# Altium project MCC17.PrjPCB
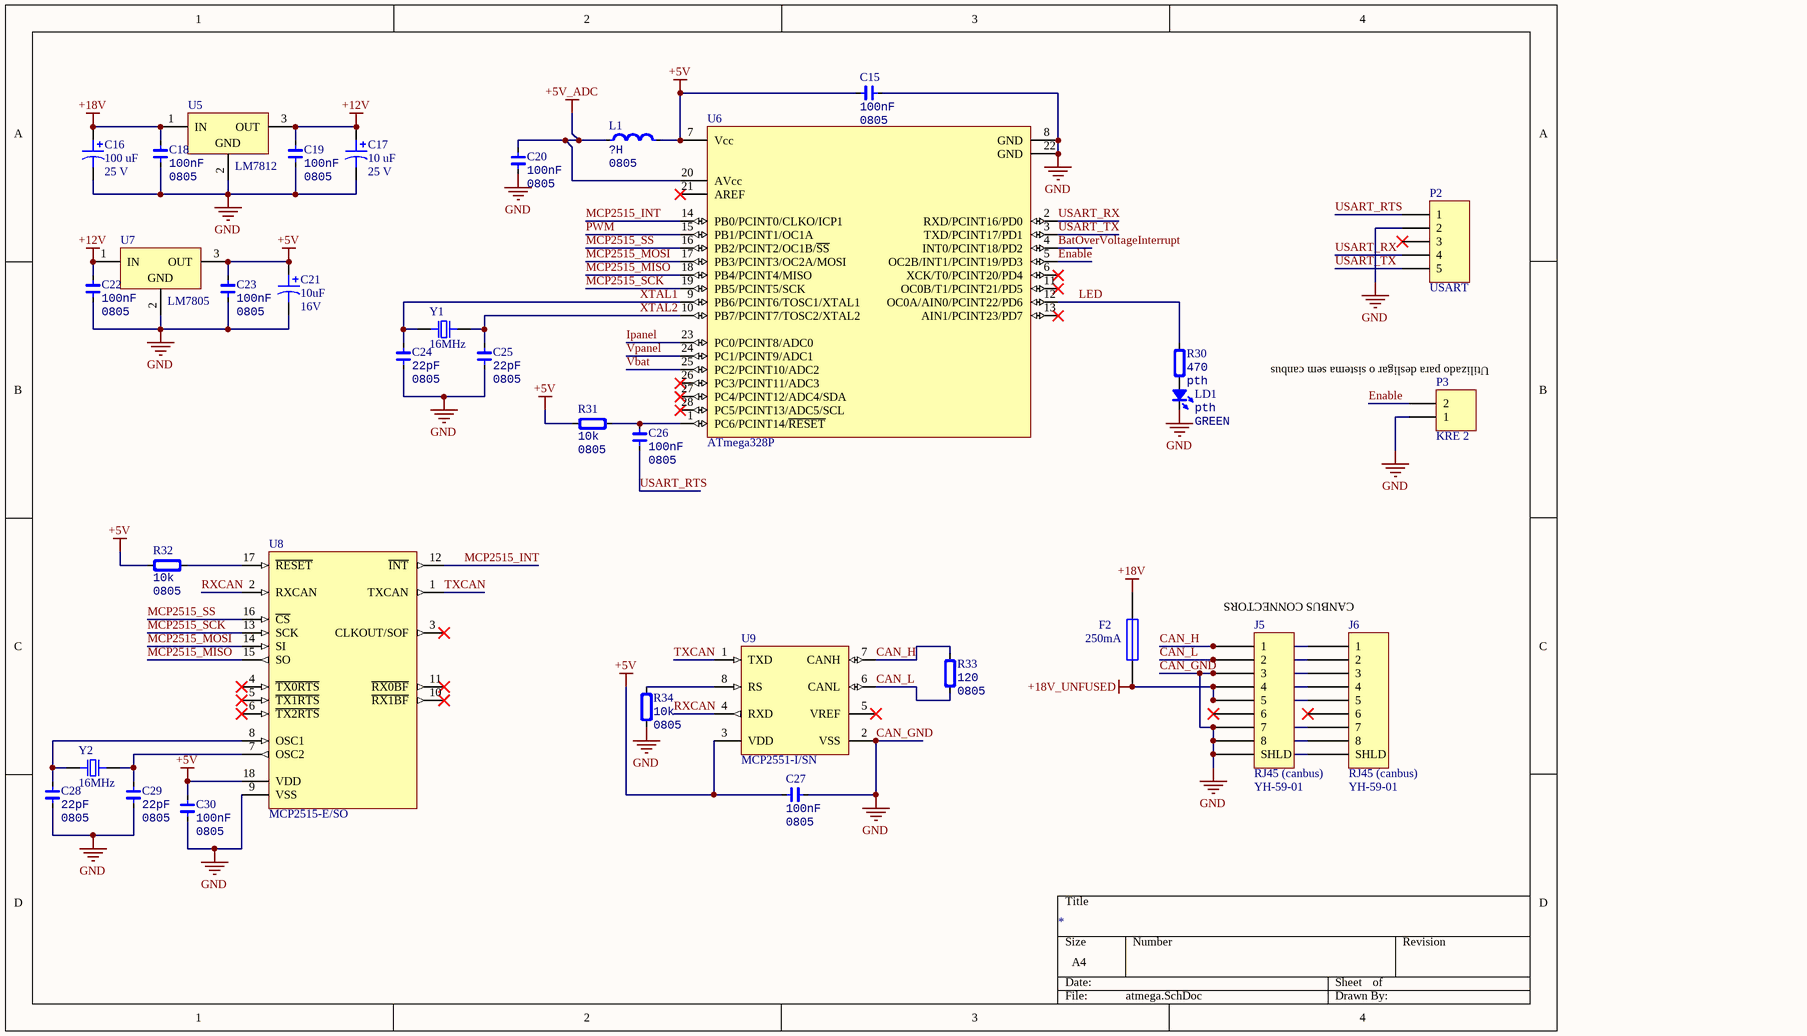
[diagram p0: atmega.SchDoc]
3 sheets, 114 parts. Net scope: global (net labels, ports and power ports of the same name join across sheets).
Board files: malllha.PcbDoc, MCC17.PcbDoc
Sheets:
  atmega.SchDoc
  signals.SchDoc
  cuk.SchDoc

## Sheet atmega.SchDoc
size A4

### Parts
C15  Type: 0805  [0805C]  (hidden comment: 100nF)
C16  value 100 uF  Voltage: 25 V  [cap10uF16V]  (hidden comment: CapacitorPol)
C17  value 10 uF  Voltage: 25 V  [cap10uF16V]  (hidden comment: CapacitorPol)
C18  Type: 0805  [0805C]  (hidden comment: 100nF)
C19  Type: 0805  [0805C]  (hidden comment: 100nF)
C20  Type: 0805  [0805C]  (hidden comment: 100nF)
C21  value 10uF  Voltage: 16V  [cap10uF16V]  (hidden comment: CapacitorPol)
C22  Type: 0805  [0805C]  (hidden comment: 100nF)
C23  Type: 0805  [0805C]  (hidden comment: 100nF)
C24  Type: 0805  [0805C]  (hidden comment: 22pF)
C25  Type: 0805  [0805C]  (hidden comment: 22pF)
C26  Type: 0805  [0805C]  (hidden comment: 100nF)
C27  Type: 0805  [0805C]  (hidden comment: 100nF)
C28  Type: 0805  [0805C]  (hidden comment: 22pF)
C29  Type: 0805  [0805C]  (hidden comment: 22pF)
C30  Type: 0805  [0805C]  (hidden comment: 100nF)
F2  250mA  [Porta Fusivel]
J5  RJ45 (canbus)  value YH-59-01  [ASSMANN A-2004-2-4-LP/FS]
J6  RJ45 (canbus)  value YH-59-01  [ASSMANN A-2004-2-4-LP/FS]
L1  Type: 0805  [0805L]  (hidden comment: ?H)
LD1  Type: pth  [LED3MM]  (hidden comment: GREEN)
P2  USART  [HDR1X5]
P3  KRE 2  [KRE_2]
R30  Type: pth  [AXIAL-0.3]  (hidden comment: 470)
R31  Type: 0805  [0805R]  (hidden comment: 10k)
R32  Type: 0805  [0805R]  (hidden comment: 10k)
R33  Type: 0805  [0805R]  (hidden comment: 120)
R34  Type: 0805  [0805R]  (hidden comment: 10k)
U5  LM7812  [TO220_deitado]
U6  ATmega328P  [DIP28-300(100)]
U7  LM7805  [TO220_deitado]
U8  MCP2515-E/SO  [WSO18_L]
U9  MCP2551-I/SN  [SOIC08-150(50)]
Y1  16MHz  [HC49-US-THT]
Y2  16MHz  [HC49-US-THT]

### Nets
+5V: C15.1 C21.1 C23.2 C27.1 C30.1 L1.2 R31.1 R32.1 U6.7(Vcc) U7.3(OUT) U8.18(VDD) U9.3(VDD)
+5V_ADC: C20.2 L1.1 U6.20(AVcc)
+12V: C17.1 C19.2 C22.2 U5.3(OUT) U7.1(IN)
+18V: C16.1 C18.2 F2.1 U5.1(IN)
+18V_UNFUSED: F2.2 J5.4 J5.5 J6.4 J6.5
CAN_GND: C15.2 C16.2 C17.2 C18.1 C19.1 C20.1 C21.2 C22.1 C23.1 C24.1 C25.1 C27.2 C28.1 C29.1 C30.2 J5.3 J5.7 J5.8 J5.S(SHLD) J6.3 J6.7 J6.8 J6.S(SHLD) LD1.2(K) P2.2 P3.1 R34.2 U5.2(GND) U6.8(GND) U6.22(GND) U7.2(GND) U8.9(VSS) U9.2(VSS)  [also labelled GND]
BatOverVoltageInterrupt: U6.4(INT0/PCINT18/PD2)
CAN_H: J5.1 J6.1 R33.2 U9.7(CANH)
CAN_L: J5.2 J6.2 R33.1 U9.6(CANL)
Enable: P3.2 U6.5(OC2B/INT1/PCINT19/PD3)
Ipanel: U6.23(PC0/PCINT8/ADC0)
LED: R30.2 U6.12(OC0A/AIN0/PCINT22/PD6)
MCP2515_INT: U6.14(PB0/PCINT0/CLKO/ICP1) U8.12(~{INT})
MCP2515_MISO: U6.18(PB4/PCINT4/MISO) U8.15(SO)
MCP2515_MOSI: U6.17(PB3/PCINT3/OC2A/MOSI) U8.14(SI)
MCP2515_SCK: U6.19(PB5/PCINT5/SCK) U8.13(SCK)
MCP2515_SS: U6.16(PB2/PCINT2/OC1B/~{SS}) U8.16(~{CS})
PWM: U6.15(PB1/PCINT1/OC1A)
RXCAN: U8.2(RXCAN) U9.4(RXD)
TXCAN: U8.1(TXCAN) U9.1(TXD)
USART_RTS: C26.2 P2.1
USART_RX: P2.4 U6.2(RXD/PCINT16/PD0)
USART_TX: P2.5 U6.3(TXD/PCINT17/PD1)
Vbat: U6.25(PC2/PCINT10/ADC2)
Vpanel: U6.24(PC1/PCINT9/ADC1)
XTAL1: C24.2 U6.9(PB6/PCINT6/TOSC1/XTAL1) Y1.1
XTAL2: C25.2 U6.10(PB7/PCINT7/TOSC2/XTAL2) Y1.2
NetC26_1: C26.1 R31.2 U6.1(PC6/PCINT14/~{RESET})
NetC28_2: C28.2 U8.8(OSC1) Y2.1
NetC29_2: C29.2 U8.7(OSC2) Y2.2
NetLD1_1: LD1.1(A) R30.1
NetR32_2: R32.2 U8.17(~{RESET})
NetR34_1: R34.1 U9.8(RS)

Not connected (* = marked no-connect by the designer): J5 6*; J6 6*; P2 3*; U6 6(XCK/T0/PCINT20/PD4)* 11(OC0B/T1/PCINT21/PD5)* 13(AIN1/PCINT23/PD7)* 21(AREF)* 26(PC3/PCINT11/ADC3)* 27(PC4/PCINT12/ADC4/SDA)* 28(PC5/PCINT13/ADC5/SCL)*; U8 3(CLKOUT/SOF)* 4(~{TX0RTS})* 5(~{TX1RTS})* 6(~{TX2RTS})* 10(~{RX1BF})* 11(~{RX0BF})*; U9 5(VREF)*

### Notes on the sheet
- Utilizado para desligar o sistema sem canbus
- CANBUS CONNECTORS

### Library data of the parts
C15 C18-C20 C22-C30 = Cap_0805: Capacitor
  C15 C18-C20 C22 C23 C26 C27 C30: Value: 100nF
  C24 C25 C28 C29: Value: 22pF
C16 C17 C21 = CapacitorPol: Solid Aluminum Capacitor with Organic Semiconductor Electrolyte: 100uF, 10V, Bulk Pack; Type: pth
F2 = Fuse 1: Fuse; Type: 5x20; Value: 250mA
J5 J6 = Modular Jack with Shield: YH-59-01; Type: RJ45
L1 = Ind_0805: Inductor; Value: ?H
LD1 = LED_0805: LED; Value: GREEN
P2 = Header 5: Header, 5-Pin; Type: header
P3 = KRE_2: Terminal Block 1x2; Type: KRE; Value: KRE 2
R30-R34 = Res_0805: Resistor
  R30: Value: 470
  R31 R32 R34: Value: 10k
  R33: Value: 120
U5 U7 = µA7805CKC: Positive-Voltage Regulator; Type: smd
U6 = ATmega328P: 8-bit AVR Microcontroller, 32KB Flash, 1KB EEPROM, 2KB SRAM, 28-pin PDIP, Industrial Grade (-40°C to 85°C); Type: smd
U8 = CMP-0186-00035-2: Stand-Alone CAN Controller With SPI Interface, 18-Pin SOIC, Extended Temperature; Type: smd
U9 = CMP-1721-00003-1: High-Speed CAN Transceiver, / 1 Mb/s, 4.5 to 5.5 V, 8-Pin SOIC (SN), Industrial Temperature, RoHS, Tube; Type: smd
Y1 Y2 = Crystal: Type: pth

## Sheet signals.SchDoc
size A4
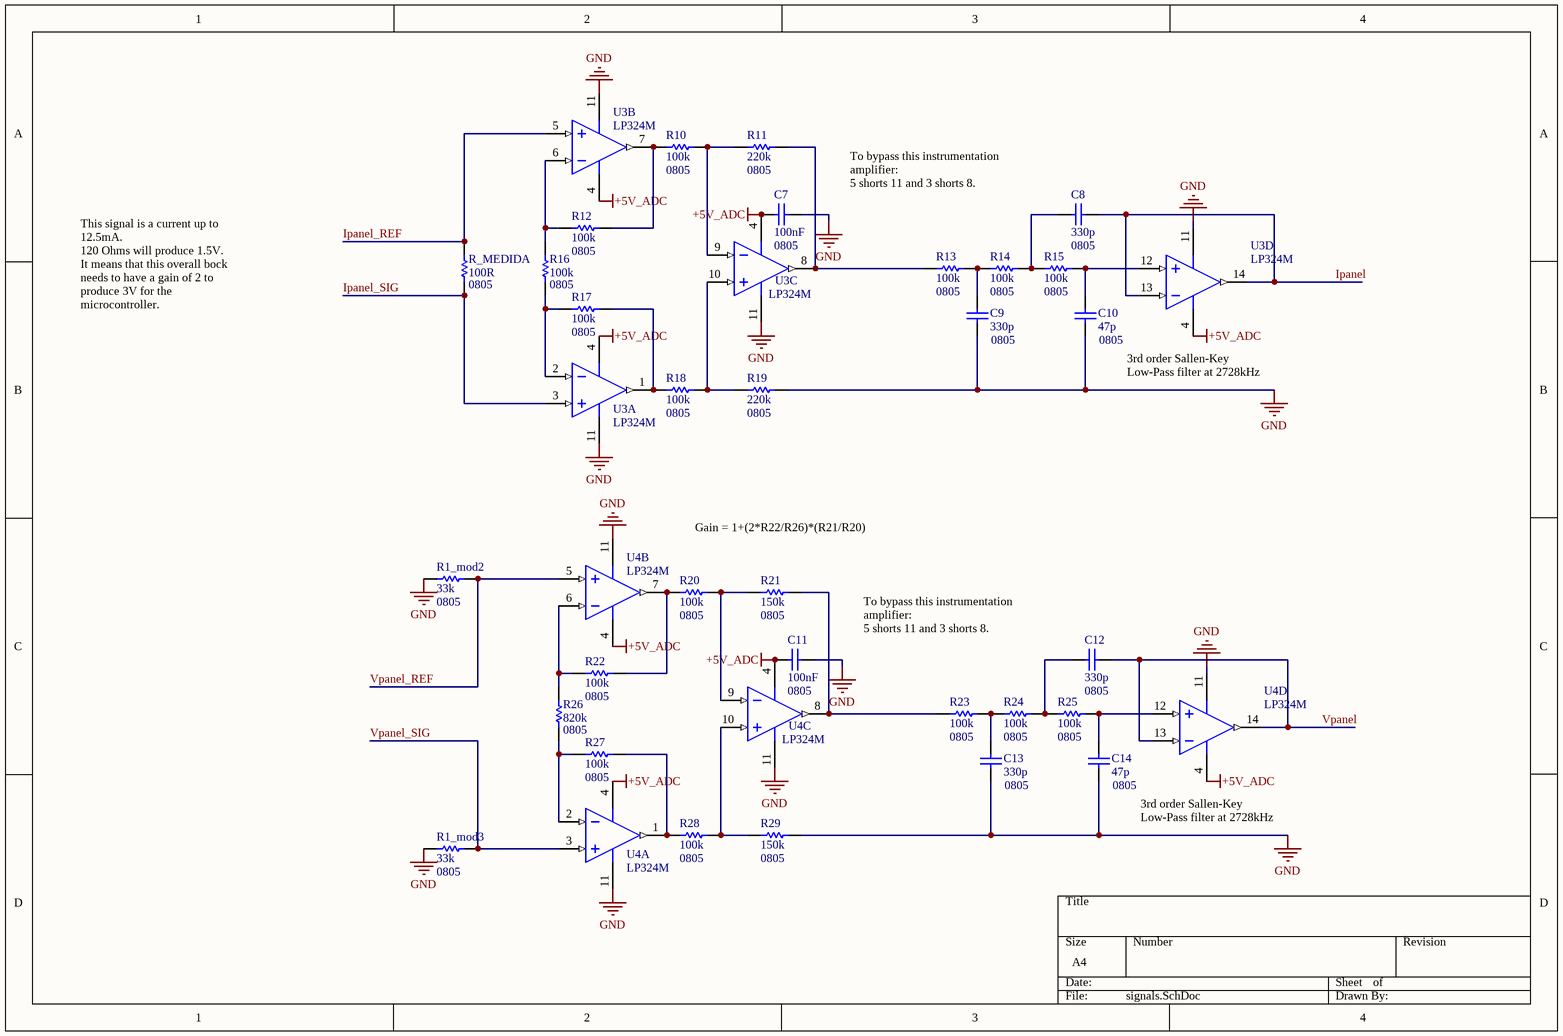
[diagram p1: signals.SchDoc]

### Parts
C7  100nF  Footprint: 0805  [0805C]
C8  330p  Footprint: 0805  [0805C]
C9  330p  Footprint: 0805  [0805C]
C10  47p  Footprint: 0805  [0805C]
C11  100nF  Footprint: 0805  [0805C]
C12  330p  Footprint: 0805  [0805C]
C13  330p  Footprint: 0805  [0805C]
C14  47p  Footprint: 0805  [0805C]
R1_mod2  33k  Type: 0805  [0805R]
R1_mod3  33k  Type: 0805  [0805R]
R10  100k  Type: 0805  [0805R]
R11  220k  Type: 0805  [0805R]
R12  100k  Type: 0805  [0805R]
R13  100k  Type: 0805  [0805R]
R14  100k  Type: 0805  [0805R]
R15  100k  Type: 0805  [0805R]
R16  100k  Type: 0805  [0805R]
R17  100k  Type: 0805  [0805R]
R18  100k  Type: 0805  [0805R]
R19  220k  Type: 0805  [0805R]
R20  100k  Type: 0805  [0805R]
R21  150k  Type: 0805  [0805R]
R22  100k  Type: 0805  [0805R]
R23  100k  Type: 0805  [0805R]
R24  100k  Type: 0805  [0805R]
R25  100k  Type: 0805  [0805R]
R26  820k  Type: 0805  [0805R]
R27  100k  Type: 0805  [0805R]
R28  100k  Type: 0805  [0805R]
R29  150k  Type: 0805  [0805R]
R_MEDIDA  100R  Type: 0805  [0805R]
U3  LP324M  [SOIC14-150(50)]  (parts A,B,C,D of 4)
U4  LP324M  [SOIC14-150(50)]  (parts A,B,C,D of 4)

### Nets
+5V_ADC: C7.2 C11.2 U3.4(V+) U4.4(V+)
GND: C7.1 C9.1 C10.1 C11.1 C13.1 C14.1 R1_mod2.2 R1_mod3.2 R19.1 R29.1 R_MEDIDA.2 U3.5(IN2+) U3.11(GND) U4.11(GND)  [also labelled Ipanel_REF]  [project net CAN_GND]
Ipanel: C8.1 U3.13(IN4-) U3.14(OUT4)
Ipanel_SIG: R_MEDIDA.1 U3.3(IN1+)
Vpanel: C12.1 U4.13(IN4-) U4.14(OUT4)
Vpanel_REF: R1_mod2.1 U4.5(IN2+)
Vpanel_SIG: R1_mod3.1 U4.3(IN1+)
NetC8_2: C8.2 R14.1 R15.2
NetC9_2: C9.2 R13.1 R14.2
NetC10_2: C10.2 R15.1 U3.12(IN4+)
NetC12_2: C12.2 R24.1 R25.2
NetC13_2: C13.2 R23.1 R24.2
NetC14_2: C14.2 R25.1 U4.12(IN4+)
NetR10_1: R10.1 R11.2 U3.9(IN3-)
NetR10_2: R10.2 R12.1 U3.7(OUT2)
NetR11_1: R11.1 R13.2 U3.8(OUT3)
NetR12_2: R12.2 R16.2 U3.6(IN2-)
NetR16_1: R16.1 R17.2 U3.2(IN1-)
NetR17_1: R17.1 R18.2 U3.1(OUT1)
NetR18_1: R18.1 R19.2 U3.10(IN3+)
NetR20_1: R20.1 R21.2 U4.9(IN3-)
NetR20_2: R20.2 R22.1 U4.7(OUT2)
NetR21_1: R21.1 R23.2 U4.8(OUT3)
NetR22_2: R22.2 R26.2 U4.6(IN2-)
NetR26_1: R26.1 R27.2 U4.2(IN1-)
NetR27_1: R27.1 R28.2 U4.1(OUT1)
NetR28_1: R28.1 R29.2 U4.10(IN3+)

### Notes on the sheet
- To bypass this instrumentation amplifier:
  5 shorts 11 and 3 shorts 8.
- This signal is a current up to 12.5mA.
  120 Ohms will produce 1.5V.
  It means that this overall bock needs to have a gain of 2 to produce 3V for the microcontroller.
- 3rd order Sallen-Key Low-Pass filter at 2728kHz
- Gain = 1+(2*R22/R26)*(R21/R20)

### Library data of the parts
C7-C14 = Cap: Capacitor; Type: smd
  C7 C11: Value: 100nF
  C8 C9 C12 C13: Value: 330p
  C10 C14: Value: 47p
R1_mod2 R1_mod3 R10-R29 R_MEDIDA = Res1: Resistor
  R1_mod2 R1_mod3: Value: 33k
  R10 R12-R18 R20 R22-R25 R27 R28: Value: 100k
  R11 R19: Value: 220k
  R21 R29: Value: 150k
  R26: Value: 820k
  R_MEDIDA: Value: 100R
U3 U4 = LP324M: Micropower Quad Operational Amplifier; Type: smd

## Sheet cuk.SchDoc
size A4
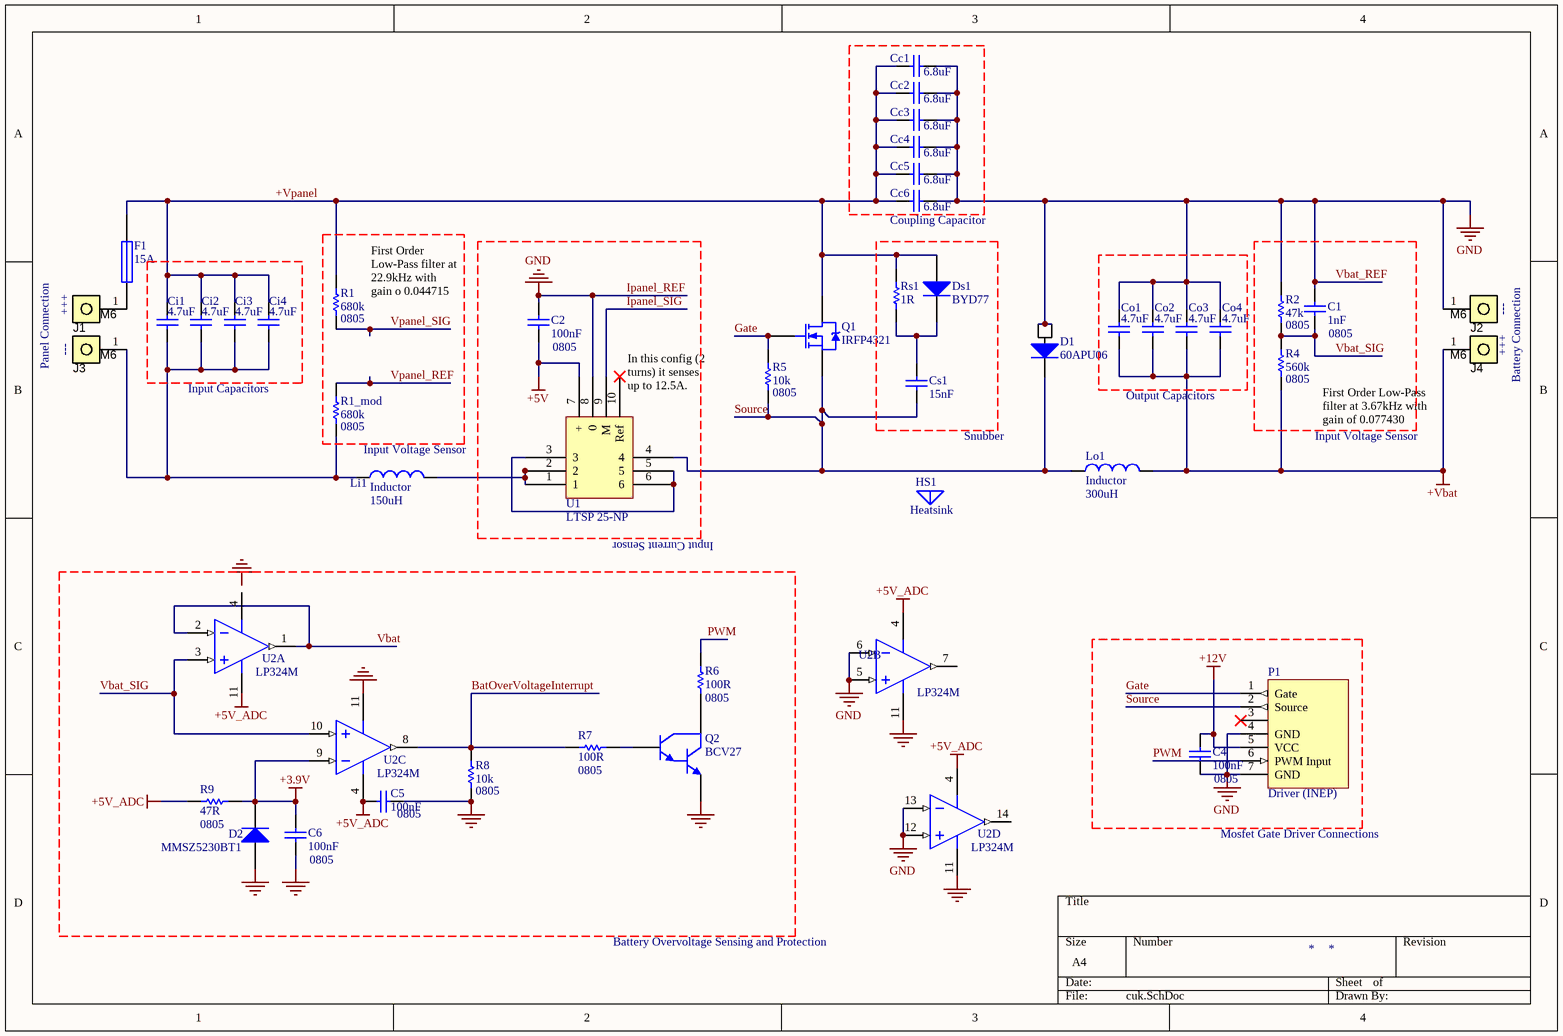
[diagram p2: cuk.SchDoc]

### Parts
C1  1nF  Footprint: 0805  [0805C]
C2  100nF  Footprint: 0805  [0805C]
C4  100nF  Footprint: 0805  [0805C]
C5  100nF  Footprint: 0805  [0805C]
C6  100nF  Footprint: 0805  [0805C]
Cc1  value 6.8uF  [CAP4U7 EPCOS]  (hidden comment: Cap)
Cc2  value 6.8uF  [CAP4U7 EPCOS]  (hidden comment: Cap)
Cc3  value 6.8uF  [CAP4U7 EPCOS]  (hidden comment: Cap)
Cc4  value 6.8uF  [CAP4U7 EPCOS]  (hidden comment: Cap)
Cc5  value 6.8uF  [CAP4U7 EPCOS]  (hidden comment: Cap)
Cc6  value 6.8uF  [CAP4U7 EPCOS]  (hidden comment: Cap)
Ci1  value 4.7uF  [cap4u7]  (hidden comment: Cap)
Ci2  value 4.7uF  [cap4u7]  (hidden comment: Cap)
Ci3  value 4.7uF  [cap4u7]  (hidden comment: Cap)
Ci4  value 4.7uF  [cap4u7]  (hidden comment: Cap)
Co1  4.7uF  [CAP4U7 EPCOS]
Co2  4.7uF  [CAP4U7 EPCOS]
Co3  4.7uF  [CAP4U7 EPCOS]
Co4  4.7uF  [CAP4U7 EPCOS]
Cs1  15nF  [100nF]
D1  60APU06  [to-247ac_horizontal]
D2  MMSZ5230BT1  [DSO-C2/X3.3]
Ds1  BYD77  [DSO-C2/X2.3]
F1  15A  [Porta Fusivel]
HS1  Heatsink  [HS10425]
J1  M6  Description: +++  [Parafuso]
J2  M6  Description: ---  [Parafuso]
J3  M6  Description: ---  [Parafuso]
J4  M6  Description: +++  [Parafuso]
Li1  Inductor  value 150uH  [NEE-42-20-DEITADO]
Lo1  Inductor  value 300uH  [NEE-42-20-DEITADO]
P1  Driver (INEP)  [Driver INEP]
Q1  IRFP4321  [to-247ac_horizontal]
Q2  BCV27  [SOT95P240-3N]
R1  680k  Type: 0805  [0805R]
R1_mod  680k  Type: 0805  [0805R]
R2  47k  Type: 0805  [0805R]
R4  560k  Type: 0805  [0805R]
R5  10k  Type: 0805  [0805R]
R6  100R  Type: 0805  [0805R]
R7  100R  Type: 0805  [0805R]
R8  10k  Type: 0805  [0805R]
R9  47R  Type: 0805  [0805R]
Rs1  1R  [AXIAL-0.3]
U1  LTSP 25-NP  [LTSP 25-NP]
U2  LP324M  [SOIC14-150(50)]  (parts A,B,C,D of 4)

### Nets
+3.9V: C6.2 D2.2(K) R9.1 U2.9(IN3-)
+5V: C2.1 U1.7(+)
+5V_ADC: C5.2 R9.2 U2.4(V+)
+12V: C4.2 P1.5(VCC)
+Vbat: Co1.1 Co2.1 Co3.1 Co4.1 J4.1 Lo1.2 R4.1
GND: C1.2 C2.2 C4.1 C5.1 C6.1 Cc1.2 Cc2.2 Cc3.2 Cc4.2 Cc5.2 Cc6.2 Co1.2 Co2.2 Co3.2 Co4.2 D1.1(A) D1.3(A) D2.1(A) J2.1 P1.4(GND) P1.7(GND) Q2.3(E) R2.2 R8.1 U1.8(0) U2.5(IN2+) U2.6(IN2-) U2.11(GND) U2.12(IN4+) U2.13(IN4-)  [also labelled Ipanel_REF, Vbat_REF]  [project net CAN_GND]
+Vpanel: Cc1.1 Cc2.1 Cc3.1 Cc4.1 Cc5.1 Cc6.1 Ci1.2 Ci2.2 Ci3.2 Ci4.2 Ds1.1(A) F1.1 Q1.2(D) R1.2 Rs1.2
BatOverVoltageInterrupt: R7.2 R8.2 U2.8(OUT3)
Gate: P1.1(Gate) Q1.1(G) R5.2
Ipanel_SIG: U1.9(M)
PWM: P1.6(PWM_Input) R6.1
Source: Cs1.1 D1.2(K) Lo1.1 P1.2(Source) Q1.3(S) R5.1 U1.4
Vbat: U2.1(OUT1) U2.2(IN1-)
Vbat_SIG: C1.1 R2.1 R4.2 U2.3(IN1+) U2.10(IN3+)
Vpanel_REF: R1_mod.2
Vpanel_SIG: R1.1
NetCi1_1: Ci1.1 Ci2.1 Ci3.1 Ci4.1 J3.1 Li1.1 R1_mod.1
NetCs1_2: Cs1.2 Ds1.2(K) Rs1.1
NetF1_2: F1.2 J1.1
NetLi1_2: Li1.2 U1.1 U1.2
NetQ2_1: Q2.1(C) R6.2
NetQ2_2: Q2.2(B) R7.1
NetU1_3: U1.3 U1.5 U1.6

Not connected (* = marked no-connect by the designer): P1 3*; U1 10(Ref)*; U2 7(OUT2) 14(OUT4)

### Notes on the sheet
- (near Cc6) Coupling Capacitor
- (near R1) First Order Low-Pass filter at 22.9kHz with gain o 0.044715
- Panel Connection
- Battery Connection
- Input Capacitors
- (near U1) In this config (2 turns) it senses up to 12.5A.
- Snubber
- Output Capacitors
- Input Voltage Sensor
- First Order Low-Pass filter at 3.67kHz with gain of 0.077430
- Input Current Sensor
- Mosfet Gate Driver Connections
- Battery Overvoltage Sensing and Protection
- Labels drawn without touching a wire or pin: +5V_ADC, GND

### Library data of the parts
C1 C2 C4-C6 = Cap: Capacitor; Type: smd
  C1: Value: 1nF
  C2 C4-C6: Value: 100nF
Cc1-Cc6 Co1-Co4 = Cap: Capacitor; Voltage: 250V
  Cc1-Cc6: Type: pth
  Co1-Co4: Value: 4.7uF; type: pth
Ci1-Ci4 = Cap: Capacitor; Voltage: 100V; Type: pth
Cs1 = Cap: Capacitor; Value: 15nF; type: pth
D1 = 60APU06: Type: pth
D2 = Diode: Zener smd 3.9V; Type: pth; Value: MMSZ5230BT1
Ds1 = Diode 1N4002: 1 Amp General Purpose Rectifier; Type: smd; value: BYD77
F1 = Fuse 1: Fuse 5x20; Type: 5x20; Value: 15A
HS1 = Antenna: Generic Antenna
J1-J4 = PIN_BIG: value: M6; type: Parafuso
P1 = Driver_INEP: Driver INEP (Soeiro); Type: header
Q1 = IRFP260: HEXFET Power MOSFET; Type: pth
Q2 = NPN1: NPN Darlington Bipolar Transistor; Type: smd; Value: BCV27
R1 R1_mod R2 R4-R9 Rs1 = Res1: Resistor
  R1 R1_mod: Value: 680k
  R2: Value: 47k
  R4: Value: 560k
  R5 R8: Value: 10k
  R6 R7: Value: 100R
  R9: Value: 47R
  Rs1: Value: 1R; type: pth
U1 = LTSP 25-NP: Current Transducer LTSP (25 A); Type: pth
U2 = LP324M: Micropower Quad Operational Amplifier; Type: smd
Li1 Lo1 = Inductor: Type: pth

## Nets that join several sheets
+5V: atmega (12 pins), cuk (C2.1 U1.7)
+5V_ADC: atmega (C20.2 L1.1 U6.20), signals (C7.2 C11.2 U3.4 U4.4), cuk (C5.2 R9.2 U2.4)
+12V: atmega (5 pins), cuk (C4.2 P1.5)
CAN_GND: atmega (33 pins), signals (14 pins), cuk (30 pins)
BatOverVoltageInterrupt: atmega (U6.4), cuk (R7.2 R8.2 U2.8)
Ipanel: atmega (U6.23), signals (C8.1 U3.13 U3.14)
Ipanel_SIG: signals (R_MEDIDA.1 U3.3), cuk (U1.9)
PWM: atmega (U6.15), cuk (P1.6 R6.1)
Vbat: atmega (U6.25), cuk (U2.1 U2.2)
Vpanel: atmega (U6.24), signals (C12.1 U4.13 U4.14)
Vpanel_REF: signals (R1_mod2.1 U4.5), cuk (R1_mod.2)
Vpanel_SIG: signals (R1_mod3.1 U4.3), cuk (R1.1)